# EAGLE design Prop_Dev_Bit_Flicker (EAGLE 7.4.0)
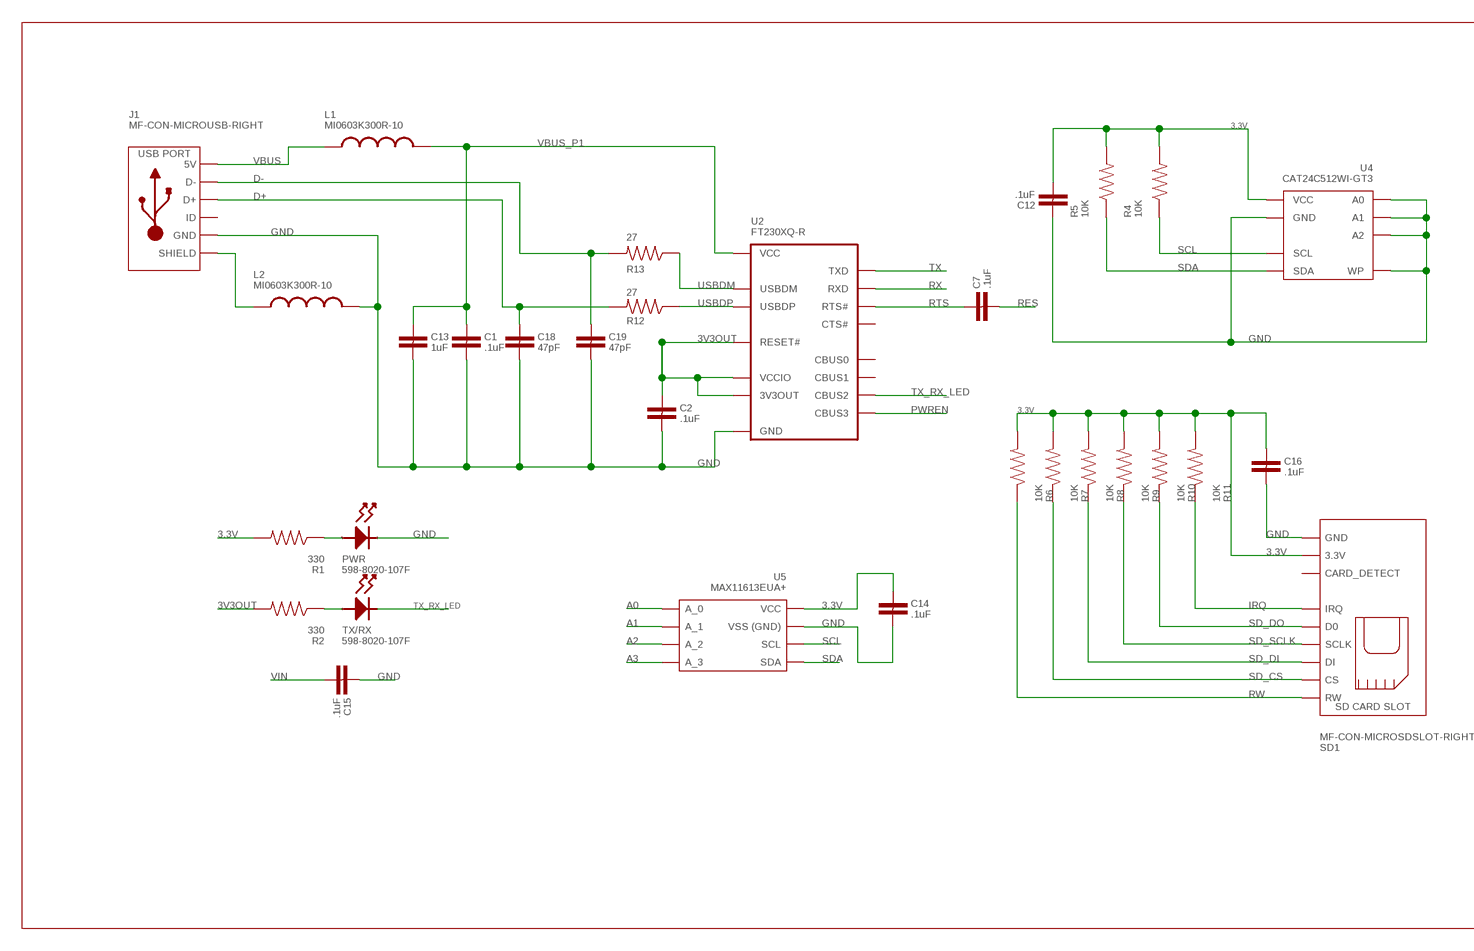
[diagram p0: schematic, sheet 1, part 1 of 2]
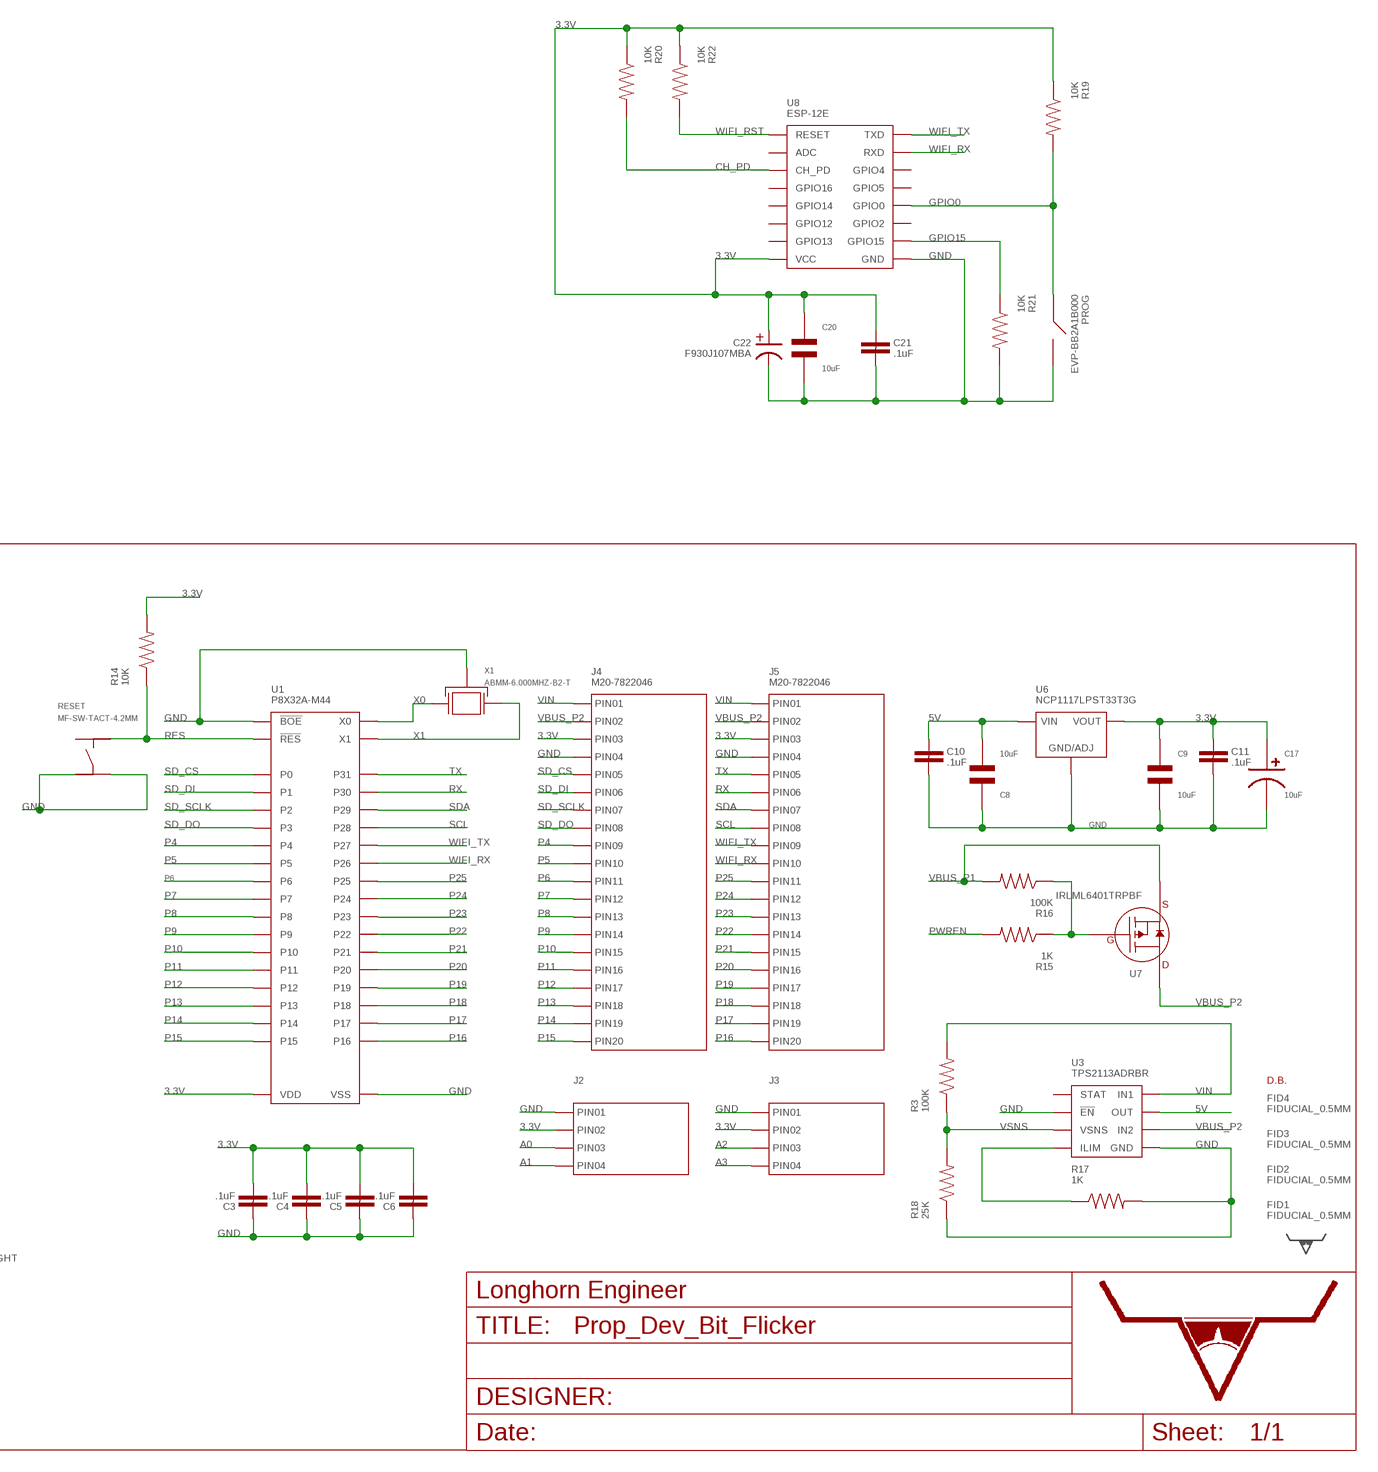
[diagram p1: schematic, sheet 1, part 2 of 2]

## Parts
C1  .1uF  CAPACITOR_NON_POLAR_0603  [0603]
C2  .1uF  CAPACITOR_NON_POLAR_0603  [0603]
C3  .1uF  CAPACITOR_NON_POLAR_0603  [0603]
C4  .1uF  CAPACITOR_NON_POLAR_0603  [0603]
C5  .1uF  CAPACITOR_NON_POLAR_0603  [0603]
C6  .1uF  CAPACITOR_NON_POLAR_0603  [0603]
C7  .1uF  CAPACITOR_NON_POLAR_0603  [0603]
C8  10uF  CAPACITOR_NP_1206  [C1206]
C9  10uF  CAPACITOR_NP_1206  [C1206]
C10  .1uF  CAPACITOR_NON_POLAR_0603  [0603]
C11  .1uF  CAPACITOR_NON_POLAR_0603  [0603]
C12  .1uF  CAPACITOR_NON_POLAR_0603  [0603]
C13  1uF  CAPACITOR_NON_POLAR_0603  [0603]
C14  .1uF  CAPACITOR_NON_POLAR_0603  [0603]
C15  .1uF  CAPACITOR_NON_POLAR_0603  [0603]
C16  .1uF  CAPACITOR_NON_POLAR_0603  [0603]
C17  10uF  CAPACITOR_P_4MM  [CP4MM]
C18  47pF  CAPACITOR_NON_POLAR_0603  [0603]
C19  47pF  CAPACITOR_NON_POLAR_0603  [0603]
C20  10uF  CAPACITOR_NP_1206  [C1206]
C21  .1uF  CAPACITOR_NON_POLAR_0603  [0603]
C22  F930J107MBA  CAPACITOR_POLARIZED_CASE_B  [CASE_B]
FID1  FIDUCIAL_0.5MM  [FIDUCIAL_0.5MM]
FID2  FIDUCIAL_0.5MM  [FIDUCIAL_0.5MM]
FID3  FIDUCIAL_0.5MM  [FIDUCIAL_0.5MM]
FID4  FIDUCIAL_0.5MM  [FIDUCIAL_0.5MM]
J1  MF-CON-MICROUSB-RIGHT  USB_MICRO_RIGHT  [MICROUSB-RIGHT]
J2  CON_01X04_2.54MM_PIN_HEADER  [2.54MM_01X04_PIN_HEADER]
J3  CON_01X04_2.54MM_PIN_HEADER  [2.54MM_01X04_PIN_HEADER]
J4  M20-7822046  CON_01X20_2.54MM_PIN_HEADER  [2.54MM_01X20_PIN_HEADER]
J5  M20-7822046  CON_01X20_2.54MM_PIN_HEADER  [2.54MM_01X20_PIN_HEADER]
L1  MI0603K300R-10  INDUCTOR_0603  [0603]
L2  MI0603K300R-10  INDUCTOR_0603  [0603]
PROG  EVP-BB2A1B000  SPST_EVPBB  [EVPBB]
PWR  598-8020-107F  LED_SINGLE_0805  [LED_0805]
R1  330  RESISTOR_0603  [0603]
R2  330  RESISTOR_0603  [0603]
R3  100K  RESISTOR_0603  [0603]
R4  10K  RESISTOR_0603  [0603]
R5  10K  RESISTOR_0603  [0603]
R6  10K  RESISTOR_0603  [0603]
R7  10K  RESISTOR_0603  [0603]
R8  10K  RESISTOR_0603  [0603]
R9  10K  RESISTOR_0603  [0603]
R10  10K  RESISTOR_0603  [0603]
R11  10K  RESISTOR_0603  [0603]
R12  27  RESISTOR_0603  [0603]
R13  27  RESISTOR_0603  [0603]
R14  10K  RESISTOR_0603  [0603]
R15  1K  RESISTOR_0603  [0603]
R16  100K  RESISTOR_0603  [0603]
R17  1K  RESISTOR_0603  [0603]
R18  25K  RESISTOR_0603  [0603]
R19  10K  RESISTOR_0603  [0603]
R20  10K  RESISTOR_0603  [0603]
R21  10K  RESISTOR_0603  [0603]
R22  10K  RESISTOR_0603  [0603]
RESET  MF-SW-TACT-4.2MM  TACT_4.2MM  [TACT4.2MM]
SD1  MF-CON-MICROSDSLOT-RIGHT  SD_CARD_SLOT_MICRO_RIGHT  [MICROSDSLOT-RIGHT]
TX/RX  598-8020-107F  LED_SINGLE_0805  [LED_0805]
U1  P8X32A-M44  [P8X32A_QFN-44]
U2  FT230XQ-R  FT230XQ  [FT230X_QFN-16]
U3  TPS2113ADRBR  TPS211(2/3)ADR  [TPS211X_SON-8]
U4  CAT24C512WI-GT3  EEPROM_I2CSOIC-8_W  [SOIC-8_W]
U5  MAX11613EUA+  [MAX11613_UMAX-8]
U6  NCP1117LPST33T3G  [SOT-223-3]
U7  IRLML6401TRPBF  MOSFET_P-CHANNEL_SINGLE_SOT-23  [SOT-23-3]
U8  ESP-12E  [ESP-12E]
U$1  LHE_FRAME  [LHE_FRAME]
U$2  LHE_LOGOLHE_LOGO  [LHE_LOGO]
U$3  DB_LOGO_SILK_SMALL  [DB_SILK_SMALL]
X1  ABMM-6.000MHZ-B2-T  XTL_7MMX5MM  [7MMX5MM]

## Nets
3.3V: C3.2 C4.2 C5.2 C6.2 C9.P$1 C11.1 C12.2 C14.1 C16.1 C17.P$1 C20.P$1 C21.1 C22.P(POS) J2.2 J3.2 J4.3 J5.3 R1.2 R4.2 R5.2 R6.2 R7.2 R8.2 R9.2 R10.2 R11.2 R14.2 R19.1 R20.1 R22.1 SD1.PIN4(3.3V) U1.8(VDD) U1.18(VDD) U1.30(VDD) U1.40(VDD) U4.8(VCC) U5.P$8(VCC) U6.P$1(VOUT) U6.P$3(VOUT) U8.P$8(VCC)
3V3OUT: C2.1 R2.2 U2.1(VCCIO) U2.8(3V3OUT) U2.9(RESET#)
5V: C8.P$2 C10.1 U3.7(OUT) U6.P$4(VIN)
A0: J2.3 U5.P$1(A_0)
A1: J2.4 U5.P$2(A_1)
A2: J3.3 U5.P$3(A_2)
A3: J3.4 U5.P$4(A_3)
CH_PD: R20.2 U8.P$3(CH_PD)
D+: C18.1 J1.3(D+) R12.2
D-: C19.1 J1.2(D-) R13.2
GND: C1.2 C2.2 C3.1 C4.1 C5.1 C6.1 C8.P$1 C9.P$2 C10.2 C11.2 C12.1 C13.2 C14.2 C15.1 C16.2 C17.P$2 C18.2 C19.2 C20.P$2 C21.2 C22.N(NEG) J1.5(GND) J2.1 J3.1 J4.4 J5.4 L2.2 PROG.P$3(B) PROG.P$4(B) PWR.CATHODE R17.2 R18.1 R21.2 RESET.P$3 RESET.P$4 SD1.G0(GND) SD1.G1(GND) SD1.PIN6(GND) U1.5(VSS) U1.6(!BOE) U1.17(VSS) U1.27(VSS) U1.39(VSS) U2.3(GND) U2.13(GND) U2.PAD(GND) U3.2(!EN) U3.5(GND) U3.PAD(GND) U4.1(A0) U4.2(A1) U4.3(A2) U4.4(GND) U4.7(WP) U5.P$7(GND) U6.P$2(GND/ADJ) U8.P$15(GND) X1.P$2(GND) X1.P$4(GND)
GPIO0: PROG.P$1(A) PROG.P$2(A) R19.2 U8.P$18(GPIO0)
GPIO15: R21.1 U8.P$16(GPIO15)
IRQ: R11.1 SD1.PIN8(IRQ)
N$1: PWR.ANODE R1.1
N$2: R2.1 TX/RX.ANODE
N$3: J1.S1(SLD) J1.S2(SLD) J1.S3(SLD) J1.S4(SLD) J1.S5(SLD) J1.S6(SLD) L2.1
N$7: R17.1 U3.4(ILIM)
N$41: R15.1 R16.1 U7.1(GATE)
P4: J4.9 U1.1(P4)
P5: J4.10 U1.2(P5)
P6: J4.11 U1.3(P6)
P7: J4.12 U1.4(P7)
P8: J4.13 U1.9(P8)
P9: J4.14 U1.10(P9)
P10: J4.15 U1.11(P10)
P11: J4.16 U1.12(P11)
P12: J4.17 U1.13(P12)
P13: J4.18 U1.14(P13)
P14: J4.19 U1.15(P14)
P15: J4.20 U1.16(P15)
P16: J5.20 U1.19(P16)
P17: J5.19 U1.20(P17)
P18: J5.18 U1.21(P18)
P19: J5.17 U1.22(P19)
P20: J5.16 U1.23(P20)
P21: J5.15 U1.24(P21)
P22: J5.14 U1.25(P22)
P23: J5.13 U1.26(P23)
P24: J5.12 U1.31(P24)
P25: J5.11 U1.32(P25)
PWREN: R15.2 U2.14(CBUS3)
RES: C7.2 R14.1 RESET.P$2 U1.7(!RES)
RTS: C7.1 U2.16(RTS#)
RW: R6.1 SD1.PIN1(RW)
RX: J5.6 U1.37(P30) U2.2(RXD)
SCL: J5.8 R4.1 U1.35(P28) U4.6(SCL) U5.P$5(SCL)
SD_CS: J4.5 R7.1 SD1.PIN2(CS) U1.41(P0)
SD_DI: J4.6 R8.1 SD1.PIN3(DI) U1.42(P1)
SD_DO: J4.8 R10.1 SD1.PIN7(D0) U1.44(P3)
SD_SCLK: J4.7 R9.1 SD1.PIN5(SCLK) U1.43(P2)
SDA: J5.7 R5.1 U1.36(P29) U4.5(SDA) U5.P$6(SDA)
TX: J5.5 U1.38(P31) U2.15(TXD)
TX_RX_LED: TX/RX.CATHODE U2.5(CBUS2)
USBDM: R13.1 U2.7(USBDM)
USBDP: R12.1 U2.6(USBDP)
VBUS: J1.1(5V) L1.1
VBUS_P1: C1.1 C13.1 L1.2 R16.2 U2.10(VCC) U7.2(SOURCE)
VBUS_P2: J4.2 J5.2 U3.6(IN2) U7.3(DRAIN)
VIN: C15.2 J4.1 J5.1 R3.2 U3.8(IN1)
VSNS: R3.1 R18.2 U3.3(VSNS)
WIFI_RST: R22.2 U8.P$1(RESET)
WIFI_RX: J5.10 U1.33(P26) U8.P$21(RXD)
WIFI_TX: J5.9 U1.34(P27) U8.P$22(TXD)
X0: U1.29(X0) X1.P$3(X1)
X1: U1.28(X1) X1.P$1(X0)
Unconnected: J1.4(ID) RESET.P$1 SD1.PIN9(CRD_DTCT) SD1.PIN10(CRD_DTCT) U2.4(CTS#) U2.11(CBUS1) U2.12(CBUS0) U3.1(STAT) U8.P$2(ADC) U8.P$4(GPIO16) U8.P$5(GPIO14) U8.P$6(GPIO12) U8.P$7(GPIO13) U8.P$17(GPIO2) U8.P$19(GPIO4) U8.P$20(GPIO5)

## Library data of the parts
C1-C7 C10-C16 C18 C19 C21 = PP_Passives:CAPACITOR_NON_POLAR: Capacitor Non Polarized
C8 C9 C20 = MF_Passives:CAPACITOR_NP: Library: MF_Passives Description: Device for Non-Polarized Capacitors. Manufacture part number (MFG#), Voltage, Temperature Coefficient, and Tolerance can be added via Attributes.; MFG#: N/A; TEMP_COF: N/A; TOLERANCE: N/A; VOLTAGE: N/A
C17 = MF_Passives:CAPACITOR_P: Library: MF_Passives Description: Device for Polarized Capacitors. Manufacture part number (MFG#), Voltage Rating, and Tolerance can be added via Attributes.; MFG#: N/A; TOLERANCE: N/A; VOLTAGE: N/A
C22 = PP_Passives:CAPACITOR_POLARIZED: Polarized capacitors
FID1-FID4 = MF_Aesthetics:FIDUCIAL: Library: MF_Aesthetics Description: Fiducial marking for PCB alignment inside PNP and other machines.
J1 = MF_Connectors:USB: Library: MF_Connectors Description: 5 Pin USB Connectors. SLD is the shield connection. Usually tied to ground through a small ferrite bead.
J2 J3 = PP_Connectors:CON_01X04: 4 Pin Connectors
J4 J5 = PP_Connectors:CON_01X20
L1 L2 = PP_Passives:INDUCTOR: Inductors
PROG = PP_Electromechanical:SPST: SPST Switches
PWR TX/RX = PP_LED:LED_SINGLE
R1-R22 = PP_Passives:RESISTOR: Resistors
RESET = MF_Switches:TACT: Library: MF_Switches Description: Device for Tact Switches. Manufacture part number (MFG#) can be added via Attributes.
SD1 = MF_Connectors:SD_CARD_SLOT: Library: MF_Connectors Description: SD Card Connector
U1 = PP_DigitalIC:P8X32A: Manufacturer Part #: P8X32A Manufacturer: Parallax Description: 32-bit Microcontrollers - MCU Propeller Chip
U2 = PP_DigitalIC:FT230X: Manufacturer Part #: FT230X Manufacturer: FTDI Description: USB Interface IC USB to Basic Serial UART IC
U3 = PP_PowerIC:TPS211(2/3): Manufacturer Part #: TPS2112 / TPS2113 Manufacturer: Texas Instruments Description: Power Switch ICs - Power Distribution Autoswitching Power Mux
U4 = PP_DigitalIC:EEPROM_I2C
U5 = PP_AnalogIC:MAX11613: Manufacturer Part #: MAX11613 Manufacturer: Maxim Integrated Description: Analog to Digital Converters - ADC 12-Bit 4Ch 94.4sps 3.6V Precision ADC
U6 = MF_IC_Power:NCP1117LP: Manufacturer Part #: NCP1117LP Manufacturer: ON Semiconductor Description: LDO Voltage Regulators
U7 = PP_DiscreteSemi:MOSFET_P-CHANNEL_SINGLE
U8 = PP_Sensors:ESP-12E
U$1 = PP_Aesthetics:LHE_FRAME; DNAME: Parker Dillmann; PNAME: Propeller Development Bit Flicker; REVNUM: REV 2
U$2 = PP_Aesthetics:LHE_LOGO
U$3 = PP_Aesthetics:DB_LOGO
X1 = MF_Frequency_Control:XTL: Library: MF_Frequency_Control Description: Device for Cyrstal Oscillators. Manufacture part number (MFG#) can be added via Attributes.

## Board
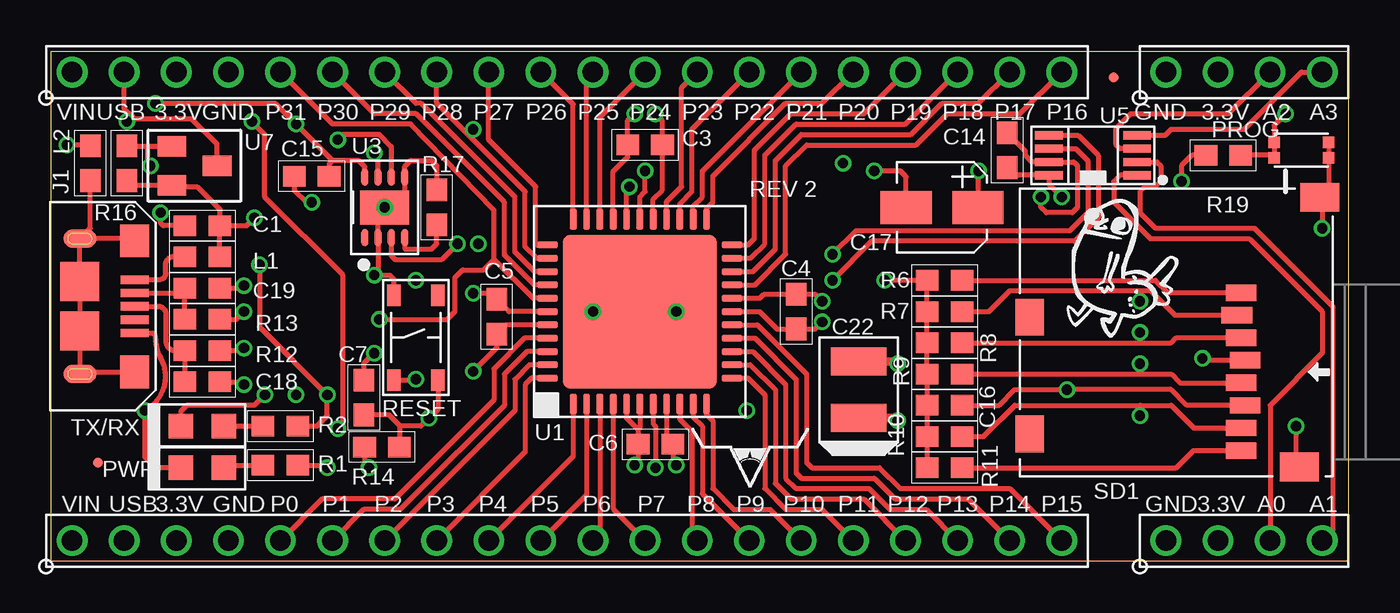
[diagram p2: board, top side]
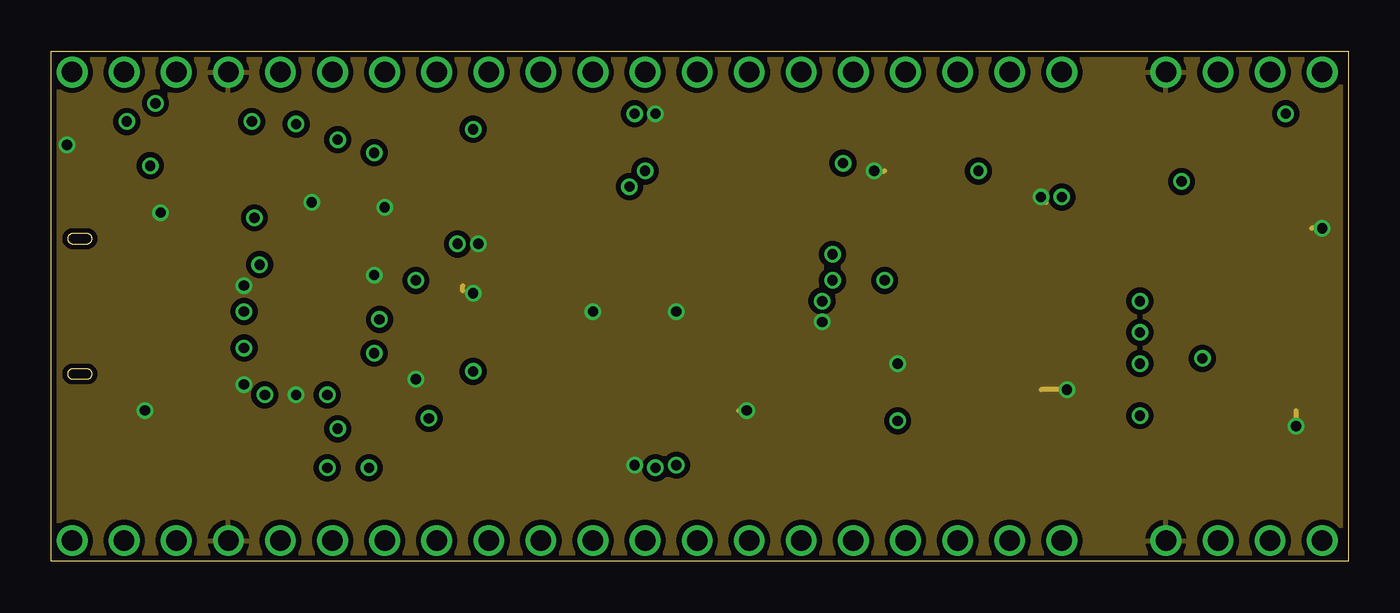
[diagram p3: board, inner layer GND]
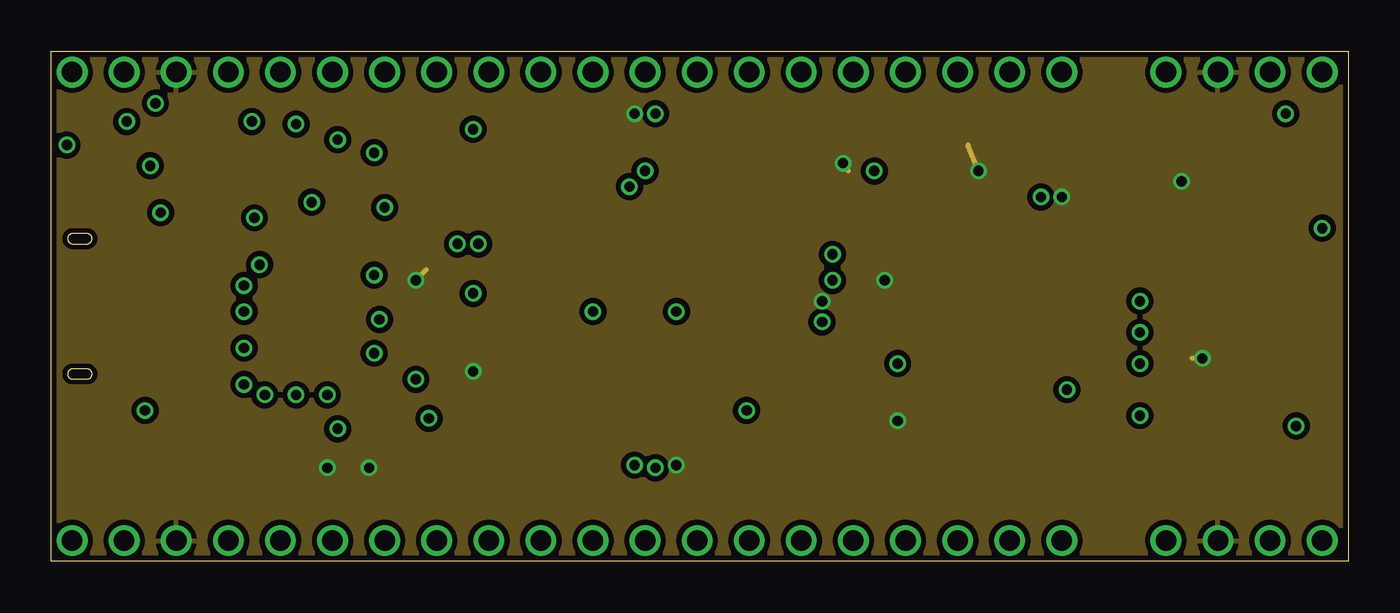
[diagram p4: board, inner layer 3.3V]
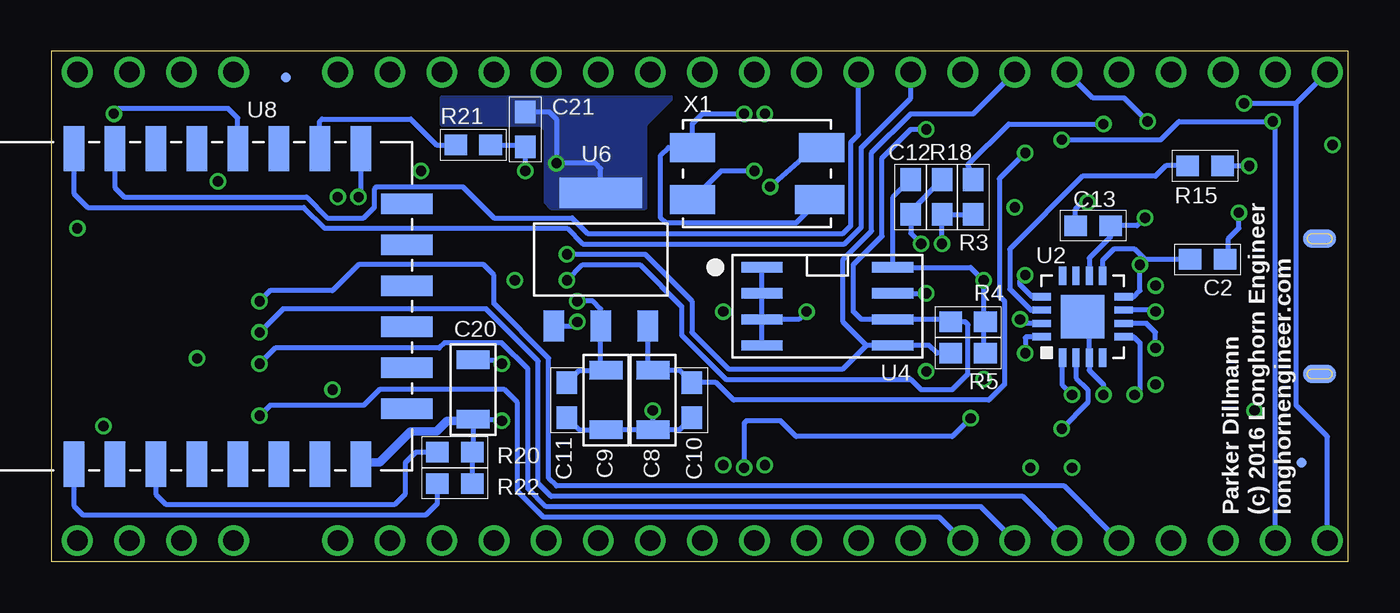
[diagram p5: board, bottom side, seen from below]

Size 63.25 x 24.89 mm. Coordinates in mm from the lower left corner, seen from the top.
Outline: 0,24.89 63.25,24.89 63.25,0 0,0 0,24.89
Copper layers (1*2*15*16): Top 0.035mm / dielectric 0.23mm / GND 0.035mm / dielectric 0.93mm / 3.3V 0.035mm / dielectric 0.23mm / Bottom 0.035mm
Design rules "MF_Standard_4_Layer": minimum track width 6mil, minimum drill 12mil, track to track 6mil, track to pad 6mil, pad to pad 6mil, via to via 6mil, smd to smd 0mil, copper to edge 10mil, drill to drill 10mil, minimum pad ring 6mil, minimum via ring 6mil, stop-mask expansion 2mil, vias tented up to drill 25mil, thermal gap 10mil

### Footprints (pad centres in the part's own frame; a part is rotated, then mirrored left to right if it is on the bottom)
0603 = smd 1.1 x 1: 1 -0.85,0; 2 0.85,0
C1206 = smd 0.9 x 1.6: P$1 -1.45,0; P$2 1.45,0
CP4MM = smd 1.6 x 2.5: P$1 0,-1.75; P$2 0,1.75
CASE_B = smd 1.35 x 2.7: N 1.375,0; P -1.375,0
FIDUCIAL_0.5MM = smd 0.5 x 0.5: FID 0,0
MICROUSB-RIGHT = smd 0.4 x 1.35: 1 -1.3,1.27; 2 -0.65,1.27; 3 0,1.27; 4 0.65,1.27; 5 1.3,1.27 | smd 0.9 x 1.6: S1 -3.3,-1.4; S2 3.3,-1.4 | smd 1.6 x 1.4: S3 -3.2,1.27; S4 3.2,1.27 | smd 1.9 x 1.9: S5 -1.2,-1.405; S6 1.2,-1.405 | smd 0.9 x 1.6 bottom: S7 -3.3,-1.4; S8 3.3,-1.4
2.54MM_01X04_PIN_HEADER = drill 1: 1 -3.81,0; 2 -1.27,0; 3 1.27,0; 4 3.81,0
2.54MM_01X20_PIN_HEADER = drill 1: 1 -24.13,0; 2 -21.59,0; 3 -19.05,0; 4 -16.51,0; 5 -13.97,0; 6 -11.43,0; 7 -8.89,0; 8 -6.35,0; 9 -3.81,0; 10 -1.27,0; 11 1.27,0; 12 3.81,0; 13 6.35,0; 14 8.89,0; 15 11.43,0; 16 13.97,0; 17 16.51,0; 18 19.05,0; 19 21.59,0; 20 24.13,0
EVPBB = smd 0.55 x 0.55: P$1 -1.325,0.375; P$2 -1.325,-0.375; P$3 1.325,-0.375; P$4 1.325,0.375
LED_0805 = smd 1.2 x 1.2: ANODE 1.05,0; CATHODE -1.05,0
TACT4.2MM = smd 1.05 x 0.65: P$1 -2.075,1.075; P$2 2.075,1.075; P$3 -2.075,-1.075; P$4 2.075,-1.075
MICROSDSLOT-RIGHT = smd 1.4 x 1.9: G0 -6.589,7.001; G1 6.561,6.001 | smd 0.8 x 1.5: PIN1 -1.939,3.151; PIN2 -0.839,2.951; PIN3 0.261,3.151; PIN4 1.361,3.351; PIN5 2.461,3.151; PIN6 3.561,3.351; PIN7 4.661,3.151; PIN8 5.761,3.151 | smd 1.8 x 1.4: PIN9 4.961,-7.149; PIN10 -0.739,-7.149
P8X32A_QFN-44 = smd 1 x 0.33: 1 -4.5,3.25; 2 -4.5,2.6; 3 -4.5,1.95; 4 -4.5,1.3; 5 -4.5,0.65; 6 -4.5,0; 7 -4.5,-0.65; 8 -4.5,-1.3; 9 -4.5,-1.95; 10 -4.5,-2.6; 11 -4.5,-3.25; 23 4.5,-3.25; 24 4.5,-2.6; 25 4.5,-1.95; 26 4.5,-1.3; 27 4.5,-0.65; 28 4.5,0; 29 4.5,0.65; 30 4.5,1.3; 31 4.5,1.95; 32 4.5,2.6; 33 4.5,3.25 | smd 0.33 x 1: 12 -3.25,-4.5; 13 -2.6,-4.5; 14 -1.95,-4.5; 15 -1.3,-4.5; 16 -0.65,-4.5; 17 0,-4.5; 18 0.65,-4.5; 19 1.3,-4.5; 20 1.95,-4.5; 21 2.6,-4.5; 22 3.25,-4.5; 34 3.25,4.5; 35 2.6,4.5; 36 1.95,4.5; 37 1.3,4.5; 38 0.65,4.5; 39 0,4.5; 40 -0.65,4.5; 41 -1.3,4.5; 42 -1.95,4.5; 43 -2.6,4.5; 44 -3.25,4.5 | smd 7.5 x 7.5: PAD 0,0
FT230X_QFN-16 = smd 0.9 x 0.35: 1 -2,0.975; 2 -2,0.325; 3 -2,-0.325; 4 -2,-0.975; 9 2,-0.975; 10 2,-0.325; 11 2,0.325; 12 2,0.975 | smd 0.35 x 0.9: 5 -0.975,-2; 6 -0.325,-2; 7 0.325,-2; 8 0.975,-2; 13 0.975,2; 14 0.325,2; 15 -0.325,2; 16 -0.975,2 | smd 2.1 x 2.1: PAD 0,0
TPS211X_SON-8 = smd 0.35 x 0.85: 1 -0.975,-1.475; 2 -0.325,-1.475; 3 0.325,-1.475; 4 0.975,-1.475; 5 0.975,1.475; 6 0.325,1.475; 7 -0.325,1.475; 8 -0.975,1.475 | smd 2.4 x 1.65: PAD 0,0
SOIC-8_W = smd 2 x 0.5: 1 -3.185,1.905; 2 -3.185,0.635; 3 -3.185,-0.635; 4 -3.185,-1.905; 5 3.185,-1.905; 6 3.185,-0.635; 7 3.185,0.635; 8 3.185,1.905
MAX11613_UMAX-8 = smd 1.35 x 0.4: P$1 -2.15,0.975; P$2 -2.15,0.325; P$3 -2.15,-0.325; P$4 -2.15,-0.975; P$5 2.15,-0.975; P$6 2.15,-0.325; P$7 2.15,0.325; P$8 2.15,0.975
SOT-223-3 = smd 4 x 1.5: P$1 0,3.25 | smd 1 x 1.5: P$2 -2.3,-3.25; P$3 0,-3.25; P$4 2.3,-3.25
SOT-23-3 = smd 1 x 1.4: 1 -0.95,-1.1; 2 0.95,-1.1; 3 0,1.1
ESP-12E = smd 2.2 x 1: P$1 -7.7,6.905; P$2 -7.7,4.905; P$3 -7.7,2.905; P$4 -7.7,0.905; P$5 -7.7,-1.095; P$6 -7.7,-3.095; P$7 -7.7,-5.095; P$8 -7.7,-7.095; P$15 7.7,-7.095; P$16 7.7,-5.095; P$17 7.7,-3.095; P$18 7.7,-1.095; P$19 7.7,0.905; P$20 7.7,2.905; P$21 7.7,4.905; P$22 7.7,6.905 | smd 1 x 2.5: P$9 -5,-9.345; P$10 -3,-9.345; P$11 -1,-9.345; P$12 1,-9.345; P$13 3,-9.345; P$14 5,-9.345
7MMX5MM = smd 2.2 x 1.4: P$1 -3.15,-1.27; P$2 -3.15,1.27; P$3 3.15,1.27 | smd 2.4 x 1.4: P$4 3.05,-1.27

### Placement (x,y rotation side)
C1  7.37,16.38 180 top
C2  6.86,14.73 0 bottom
C3  28.96,20.32 180 top
C4  36.32,12.19 90 top
C5  21.72,11.94 270 top
C6  29.46,5.71 0 top
C7  15.24,8 270 top
C8  33.91,7.87 90 bottom
C9  36.2,7.87 270 bottom
C10  32,7.87 270 bottom
C11  38.1,7.87 270 bottom
C12  21.34,17.78 90 bottom
C13  12.45,16.38 180 bottom
C14  46.61,20.07 90 top
C15  12.7,18.8 0 top
C16  43.56,7.62 0 top
C17  43.43,17.27 90 top
C18  7.37,8.76 0 top
C19  7.37,13.34 0 top
C20  42.67,8.38 90 bottom
C21  40.13,21.08 270 bottom
C22  39.37,8.38 90 top
FID1  2.29,4.83 0 top
FID2  51.82,23.62 0 top
FID3  2.29,4.83 0 bottom
FID4  51.82,23.62 0 bottom
J1  2.79,12.45 270 top
J2  58.17,1.02 0 top
J3  58.17,23.88 0 top
J4  25.15,1.02 0 top
J5  25.15,23.88 0 top
L1  7.37,14.86 0 top
L2  1.91,19.43 90 top
PROG  60.96,20.07 0 top
PWR  7.37,4.57 0 top
R1  11.18,4.7 0 top
R2  11.18,6.6 0 top
R3  18.29,17.78 90 bottom
R4  18.54,11.68 0 bottom
R5  18.54,10.16 0 bottom
R6  43.56,13.72 180 top
R7  43.56,12.19 180 top
R8  43.56,10.67 180 top
R9  43.56,9.14 180 top
R10  43.56,6.1 180 top
R11  43.56,4.57 180 top
R12  7.37,10.29 180 top
R13  7.37,11.81 180 top
R14  16.13,5.59 180 top
R15  6.99,19.3 180 bottom
R16  3.68,19.43 270 top
R17  18.8,17.27 90 top
R18  19.81,17.78 270 bottom
R19  57.15,19.81 0 top
R20  43.56,5.33 180 bottom
R21  42.67,20.32 0 bottom
R22  43.56,3.81 180 bottom
RESET  17.78,10.92 270 top
SD1  54.86,11.18 270 top
TX/RX  7.37,6.6 0 top
U1  28.7,12.19 90 top
U2  12.95,11.94 90 bottom
U3  16.26,17.27 0 top
U4  25.4,12.45 0 bottom
U5  50.8,19.81 180 top
U6  36.45,14.73 0 bottom
U7  6.99,19.3 270 top
U8  55.24,12.45 90 bottom
U$1  -1.02,2.29 90 bottom
U$2  36.07,3.56 0 top
U$3  49.53,10.92 0 top
X1  28.83,18.92 0 bottom

### Tracks (layer width: path | path; a pad name or v marks a point on that pad's centre or on a via)
3.3V  (via drill 0.5)
  Top 0.254: R1.2 13.34,4.7 v13.46,4.57 | R14.2 15.28,4.79 v15.49,4.57 | R11.2 R10.2 C16.1 R9.2 R8.2 R7.2 R6.2 v40.64,13.72 | v30.48,4.7 30.31,4.79 C6.2 30,5.9 U1.8 | U1.30 27.4,19.02 28.11,19.72 C3.2 28.11,21.5 v28.45,21.84 | U1.18 34.56,12.84 34.76,13.04 C4.2 37.25,13.04 v37.59,12.7 | SD1.PIN4 56.23,9.81 v56.13,9.91 | C14.1 47.12,18.84 U5.P$8 48.65,18.41 v49.28,17.78 | C17.P$1 45.47,17.55 45.21,17.81 v45.21,19.05 | U1.40 22.17,11.54 C5.2 21.72,10.41 v20.57,9.27 | R19.1 55.63,19.81 55.12,19.3 v55.12,18.54
  Top 0.406: C22.P 41.13,7.01 v41.27,6.86
  3.3V 0.254: v13.46,4.57 13.46,4.32 | v15.49,4.57 15.75,4.57 | v17.78,13.72 18.29,14.22 | v37.59,12.7 37.85,12.7 | v56.13,9.91 55.63,9.91 | v45.21,19.05 44.7,20.32 | v41.27,6.86 41.27,6.6 | v38.61,19.43 38.86,19.05 | v49.28,17.78 49.28,17.53 | v40.64,13.72 40.64,13.97
  Bottom 0.254: 22.73,14.35 U4.8 | U4.8 18.41,14.35 v17.78,13.72 17.78,11.68 | 17.78,11.68 R4.2 | 17.78,11.68 17.78,10.16 R5.2 | C20.P$1 42.67,5.37 R20.1 R22.1 | 42.75,6.86 C20.P$1 | C20.P$1 41.35,6.93 v41.27,6.86 | 40.22,21.84 C21.1 38.95,21.93 38.61,21.59 v38.61,19.43 36.7,19.43 36.45,19.18 U6.P$1 | v37.59,12.7 36.83,12.7 36.45,12.32 U6.P$3 36.45,9.45 C9.P$1 37.5,9.32 C11.1 | C12.2 22.21,17.75 U4.8
  Bottom 0.406: 42.75,6.86 43.94,6.86 44.45,6.35 45.72,6.35 47.24,4.83 48.07,4.83 U8.P$8
  pour 3.3V (isolate 0.254, rank 6): 0,24.89 63.25,24.89 63.25,0 0,0
  pour Bottom (isolate 0.254, rank 6, no thermals): 38.86,17.27 34.29,17.27 34.29,21.08 34.29,21.34 33.02,22.61 44.2,22.61 44.2,21.34 39.37,21.34 39.12,21.08 39.12,17.53
3V3OUT  (via drill 0.5)
  Top 0.254: R2.2 12.95,6.6 13.46,7.11 v13.46,8.13 10.16,11.43 v10.16,14.48
  Bottom 0.254: v13.46,8.13 13.93,8.6 U2.1 | C2.1 9.91,14.73 | 9.91,14.73 10.41,15.24 11.43,15.24 11.98,14.69 U2.9 | U2.8 10.46,12.91 10.16,13.21 v10.16,14.48 9.91,14.73
5V  (via drill 0.5)
  Top 0.254: U3.7 15.93,19.76 v15.75,19.94
  Bottom 0.254: v15.75,19.94 17.02,18.67 17.02,12.95 16.76,12.7 16.76,8.64 17.53,7.87 29.97,7.87 30.82,8.72 C10.1 32.6,9.32 C8.P$2 34.15,9.44 U6.P$4
A0
  Top 0.254: U5.P$1 52.11,18.84 51.82,18.54 51.82,17.53 53.59,15.75 58.42,15.75 61.98,12.19 61.98,10.16 59.44,7.62 J2.3
A1
  Top 0.254: U5.P$2 53.92,19.49 54.1,19.3 54.1,18.54 53.85,18.29 53.34,18.29 53.09,18.03 53.09,17.02 53.85,16.26 58.67,16.26 62.48,12.45 62.48,1.52 J2.4
A2
  Top 0.254: U5.P$3 52.1,20.14 51.91,20.32 51.91,21.12 52.64,21.84 57.4,21.84 J3.3
A3
  Top 0.254: J3.4 60.96,23.88 58.17,21.08 54.61,21.08 54.31,20.79 U5.P$4
CH_PD
  Bottom 0.254: U8.P$3 58.15,3.29 57.66,2.79 46.48,2.79 45.97,3.3 45.97,4.83 45.47,5.33 R20.2
D+
  Top 0.254: J1.3 5.23,12.45 arc-90 5.59,12.09 5.59,10.74 arc90 6.05,10.29 R12.2 C18.1
D-
  Top 0.254: J1.2 6.28,13.1 C19.1 R13.2
GND  (via drill 0.5)
  Top 0.254: C18.2 9.27,8.76 v9.4,8.64 | C19.2 9.27,13.34 v9.4,13.46 | C1.2 5.46,16.38 5.33,16.51 v5.33,17.02 | L2.2 1.87,20.32 v0.76,20.32 | J1.5 4.86,11.15 arc-90 5.08,10.92 arc28 5.33,9.91 arc-90 v4.57,7.37 4.57,5.08 5.08,4.57 PWR.CATHODE | RESET.P$3 16.7,13.78 16.51,13.97 v15.75,13.97 15.93,14.15 U3.2 15.93,16.95 U3.PAD 17.02,17.27 17.23,17.48 U3.5 17.23,19.26 17.53,19.56 18.54,19.56 18.8,19.3 R17.2 | C15.1 11.85,18.12 12.45,17.53 v12.7,17.53 | RESET.P$4 17.74,8.85 v17.78,8.89 | C16.2 46.23,7.62 46.99,8.38 v49.53,8.38 54.61,8.38 55.38,7.62 SD1.PIN6 | v61.98,16.26 61.98,17.65 SD1.G0 62.28,17.77 PROG.P$3 PROG.P$4 | SD1.G1 60.71,5.03 v60.71,6.6 | U1.5 28.05,7 28.61,6.44 | 28.61,6.44 C6.1 28.61,4.79 v28.45,4.7 | U1.6 28.7,6.53 28.61,6.44 | U1.27 29.35,17.67 29.81,18.12 C3.1 29.81,21.5 v29.46,21.84 | U1.17 34.54,12.19 35.39,11.34 C4.1 37.25,11.34 v37.59,11.68 | C14.2 47.5,20.03 47.5,19.81 47.82,19.49 U5.P$7 49.85,19.49 50.04,19.3 50.04,17.27 49.78,17.02 48.51,17.02 48.26,17.27 v48.26,17.78 | U1.39 22.31,12.19 C5.1 21.42,13.08 v20.57,13.08 | C17.P$2 41.68,18.77 41.4,19.05 v40.13,19.05
  Top 0.406: C22.N 41.17,9.76 v41.27,9.65
  GND 0.254: v9.4,8.64 9.65,8.64 | v9.4,13.46 9.4,13.72 | v5.33,17.02 5.08,17.02 | v0.76,20.32 0.76,20.57 | v4.57,7.37 4.57,7.11 | v12.7,17.53 12.45,17.53 | v17.78,8.89 17.78,9.14 | v49.53,8.38 48.26,8.38 | v61.98,16.26 61.47,16.26 | v60.71,6.6 60.71,7.37 | 20.07,13.21 20.07,13.46 | v37.59,11.68 37.59,11.94 | v41.27,9.65 41.02,9.65 | v40.13,19.05 40.64,19.05 | v48.26,17.78 48.51,17.53 | v33.91,7.37 33.53,7.37 | v20.57,13.08 20.57,13.21 | v20.83,15.49 20.83,15.75
  Bottom 0.254: C2.2 5.84,14.9 5.84,15.75 5.33,16.26 v5.33,17.02 | U2.PAD 12.63,11.94 U2.3 12.63,9.33 11.94,8.64 v11.94,8.13 | U2.13 15.41,12.91 16,13.5 16,13.72 v15.75,13.97 | C13.2 13.3,17.18 12.95,17.53 v12.7,17.53 | U4.4 U4.3 | U4.3 U4.2 U4.1 | v29.46,21.84 31.5,21.84 31.98,21.36 X1.P$2 33.15,20.19 33.53,19.81 33.53,16.76 33.27,16.51 26.92,16.51 X1.P$4 | v26.42,12.19 26.8,11.81 U4.3 | C20.P$2 41.45,9.83 v41.27,9.65 | v40.13,19.05 C21.2 40.22,20.32 R21.2 | U8.P$15 48.15,17.89 v48.26,17.78 | U6.P$2 37.79,11.48 v37.59,11.68 | C10.2 32.6,6.42 C8.P$1 | C8.P$1 v33.91,7.37 | C8.P$1 C9.P$2 37.5,6.42 C11.2 | U4.7 v20.57,13.08 | R18.1 21.34,17.11 C12.1 21.34,16 v20.83,15.49
  other vias: 30.48,12.19 16.26,17.27
  pour GND (isolate 0.254, rank 6): 0,24.89 63.25,24.89 63.25,0 0,0
GPIO0  (via drill 0.5)
  Top 0.254: v60.2,21.84 59.63,21.28 PROG.P$1 PROG.P$2 59.51,19.81 R19.2
  Bottom 0.254: U8.P$18 54.15,21.64 54.61,22.1 59.94,22.1 v60.2,21.84
GPIO15
  Bottom 0.254: U8.P$16 50.15,21.48 50.04,21.59 45.72,21.59 44.45,20.32 R21.1
IRQ
  Top 0.254: R11.1 54.86,4.57 55.71,5.42 SD1.PIN8
N$1
  Top 0.254: PWR.ANODE 8.54,4.7 R1.1
N$2
  Top 0.254: TX/RX.ANODE R2.1
N$3
  Top 0.254: J1.S1 1.91,16.26 L2.1 | J1.S3 3.96,15.75 J1.S1 | J1.S1 J1.S5 J1.S6 J1.S2 1.49,9.25 J1.S4
N$7
  Top 0.254: U3.4 17.23,15.28 17.27,15.24 18.54,15.24 18.8,15.49 R17.1
N$41  (via drill 0.5)
  Top 0.254: R16.1 3.71,20.25 4.7,20.25 | 4.7,20.25 U7.1 | v4.83,19.3 4.7,19.43 4.7,20.25
  Bottom 0.254: R15.1 v4.83,19.3
P4
  Top 0.254: U1.1 25.45,5.13 J4.9
P5
  Top 0.254: U1.2 26.1,3.24 J4.10
P6
  Top 0.254: U1.3 26.75,1.35 J4.11
P7
  Top 0.254: U1.4 27.4,2.57 J4.12
P8
  Top 0.254: U1.9 30.65,6.94 31.24,6.35 31.24,1.27 J4.13
P9
  Top 0.254: U1.10 31.3,7.05 31.75,6.6 31.75,3.3 J4.14
P10
  Top 0.254: U1.11 31.95,7.16 32.26,6.86 32.26,3.56 33.27,2.54 35.05,2.54 J4.15
P11
  Top 0.254: U1.12 33.98,8.94 34.8,8.13 34.8,3.56 35.81,2.54 37.59,2.54 J4.16
P12
  Top 0.254: U1.13 34.1,9.59 35.31,8.38 35.31,3.81 36.07,3.05 39.62,3.05 J4.17
P13
  Top 0.254: U1.14 34.21,10.24 35.81,8.64 35.81,4.06 36.32,3.56 39.88,3.56 40.89,2.54 42.67,2.54 J4.18
P14
  Top 0.254: U1.15 34.32,10.89 36.32,8.89 36.32,4.32 36.58,4.06 40.13,4.06 41.15,3.05 44.7,3.05 J4.19
P15
  Top 0.254: U1.16 34.43,11.54 36.83,9.14 36.83,4.83 37.08,4.57 40.39,4.57 41.4,3.56 46.74,3.56 J4.20
P16
  Top 0.254: U1.19 34.32,13.49 35.81,14.99 35.81,19.3 36.83,20.32 42.16,20.32 43.69,21.84 47.24,21.84 J5.20
P17
  Top 0.254: U1.20 34.21,14.14 35.31,15.24 35.31,19.56 36.58,20.83 41.91,20.83 43.43,22.35 45.21,22.35 J5.19
P18
  Top 0.254: U1.21 34.1,14.79 34.8,15.49 34.8,19.81 36.32,21.34 41.66,21.34 J5.18
P19
  Top 0.254: U1.22 33.98,15.44 34.29,15.75 34.29,20.07 36.07,21.84 39.62,21.84 J5.17
P20
  Top 0.254: U1.23 31.95,17.22 32.26,17.53 32.26,18.8 35.81,22.35 37.59,22.35 J5.16
P21
  Top 0.254: U1.24 31.3,17.33 31.75,17.78 31.75,19.05 J5.15
P22
  Top 0.254: U1.25 30.65,17.44 31.24,18.03 31.24,21.08 J5.14
P23
  Top 0.254: U1.26 30,17.56 30.73,18.29 30.73,23.11 J5.13
P24
  Top 0.254: U1.31 26.75,21.67 J5.12
P25
  Top 0.254: U1.32 26.1,23.56 J5.11
PWREN
  Bottom 0.254: R15.2 8.89,19.3 9.4,18.8 12.95,18.8 16.51,15.24 16.51,13.29 15.48,12.26 U2.14
RES  (via drill 0.5)
  Top 0.254: R14.1 17.02,5.63 17.02,6.6 | 17.02,6.6 16.47,7.15 C7.2 | RESET.P$2 18.86,7.42 v18.41,6.99 18.03,6.6 17.02,6.6 | U1.7 29.35,6.72 29.46,6.6 v29.46,4.57
  Bottom 0.254: v18.41,6.99 19.3,6.1 26.92,6.1 27.69,6.86 29.35,6.86 29.46,6.75 v29.46,4.57
RTS  (via drill 0.5)
  Top 0.254: v15.75,10.16 15.24,9.65 C7.1
  Bottom 0.254: U2.16 15.71,10.96 15.75,10.92 v15.75,10.16
RW
  Top 0.254: R6.1 53.85,13.72 54.45,13.12 SD1.PIN1
RX  (via drill 0.5)
  Top 0.254: U1.37 23.56,13.49 22.1,14.96 22.1,17.53 17.78,21.84 15.75,21.84 J5.6 | v13.97,6.48 14.22,6.73 14.22,13.97 10.41,17.78 10.41,20.83 v9.78,21.46
  Bottom 0.254: U2.2 13.28,8.96 12.7,8.38 12.7,7.75 v13.97,6.48 | v9.78,21.46 10.92,22.61 12.45,22.61 J5.6
SCL  (via drill 0.5)
  Top 0.254: U1.35 23.66,14.79 23.11,15.34 23.11,18.03 20.19,20.95 | 20.19,20.95 18.8,22.35 J5.8 | v20.57,21.08 20.32,21.08 20.19,20.95 | U5.P$5 50.08,20.79 51.05,19.81 51.05,16.76 49.91,15.62 40.01,15.62 v38.1,13.72
  Bottom 0.254: v20.57,21.08 21.34,21.08 22.73,19.68 22.73,15.88 24.13,14.48 24.13,12.19 23.75,11.81 U4.6 19.01,11.81 R4.1 18.67,11.68 18.54,11.56 18.54,9.14 19.3,8.38 20.83,8.38 21.34,8.89 30.35,8.89 32.51,11.05 32.51,12.45 34.54,14.48 37.34,14.48 v38.1,13.72
SD_CS  (via drill 0.5)
  Top 0.254: U1.41 23.08,10.89 21.59,9.4 21.59,7.87 16.76,3.05 13.21,3.05 J4.5 | R7.1 45.72,12.19 46.74,13.21 53.09,13.21 | 53.09,13.21 53.59,13.21 54.79,12.02 SD1.PIN2 | v53.09,12.7 53.09,13.21
  Bottom 0.254: J4.5 13.84,3.68 38.61,3.68 38.99,4.06 38.99,9.91 41.66,12.57 41.66,13.97 42.16,14.48 48.26,14.48 49.53,13.21 52.58,13.21 v53.09,12.7
SD_DI  (via drill 0.5)
  Top 0.254: R8.1 53.09,10.67 | 53.09,10.67 54.61,10.67 54.86,10.92 58.01,10.92 SD1.PIN3 | U1.42 23.2,10.24 22.1,9.14 22.1,7.62 17.53,3.05 17.02,2.54 15.24,2.54 J4.6 | v53.09,11.18 53.09,10.67
  Bottom 0.254: J4.6 15.88,3.17 38.86,3.17 39.5,3.81 39.5,9.78 42.04,12.32 51.94,12.32 v53.09,11.18
SD_DO  (via drill 0.5)
  Top 0.254: R10.1 45.47,6.1 46.99,7.62 53.09,7.62 | 53.09,7.62 54.61,7.62 55.72,6.51 SD1.PIN7 | U1.44 23.42,8.94 23.11,8.64 23.11,5.33 J4.8 | v53.09,7.11 53.09,7.62
  Bottom 0.254: J4.8 19.94,2.16 39.24,2.16 40.51,3.43 40.51,7.75 41.15,8.38 47.24,8.38 48.01,7.62 52.58,7.62 v53.09,7.11
SD_SCLK  (via drill 0.5)
  Top 0.254: R9.1 53.09,9.14 | 53.09,9.14 54.61,9.14 55.04,8.71 SD1.PIN5 | U1.43 23.31,9.59 22.61,8.89 22.61,7.37 17.78,2.54 J4.7 | v53.09,9.65 53.09,9.14
  Bottom 0.254: J4.7 17.91,2.67 39.12,2.67 40.01,3.56 40.01,9.4 41.27,10.67 44.07,10.67 44.32,10.41 52.32,10.41 v53.09,9.65
SDA  (via drill 0.5)
  Top 0.254: U1.36 23.57,14.14 22.61,15.11 22.61,17.78 18.03,22.35 17.78,22.35 J5.7 | U5.P$6 49.97,20.14 50.55,19.56 50.55,17.02 49.66,16.13 39.24,16.13 v38.1,14.99
  Bottom 0.254: R5.1 20.07,10.16 20.45,10.54 U4.5 23.5,10.54 | 23.5,10.54 24.64,11.68 24.64,14.73 23.24,16.13 23.24,19.94 21.34,21.84 18.29,21.84 J5.7 | 23.5,10.54 24.64,9.4 30.23,9.4 32,11.18 32,12.7 34.29,14.99 v38.1,14.99
TX  (via drill 0.5)
  Top 0.254: U1.38 23.49,12.84 21.59,14.74 | 21.59,14.74 21.59,17.14 17.53,21.34 13.72,21.34 J5.5 | v16,11.81 19.3,11.81 19.68,12.19 19.68,13.84 20.07,14.22 21.08,14.22 21.59,14.74
  Bottom 0.254: U2.15 15.8,11.61 v16,11.81
TX_RX_LED  (via drill 0.5)
  Top 0.254: v10.41,8.13 9.91,7.62 6.6,7.62 6.32,7.33 TX/RX.CATHODE
  Bottom 0.254: U2.5 10.46,10.96 10.16,10.67 10.16,8.38 v10.41,8.13
USBDM  (via drill 0.5)
  Top 0.254: R13.1 9.02,11.81 v9.4,12.19
  Bottom 0.254: v9.4,12.19 9.47,12.26 U2.7
USBDP  (via drill 0.5)
  Top 0.254: R12.1 9.27,10.29 v9.4,10.41
  Bottom 0.254: v9.4,10.41 9.4,11.18 9.84,11.61 U2.6
VBUS
  Top 0.254: J1.1 5.25,13.75 arc90 5.59,14.09 5.59,14.57 arc-90 6.13,14.86 L1.1
VBUS_P1  (via drill 0.5)
  Top 0.254: L1.2 C1.1 | R16.2 3.91,18.35 U7.2 5.95,18.29 7.11,18.29 8.22,17.18 C1.1 | C1.1 9.53,16.38 v9.91,16.76
  Bottom 0.254: U2.10 12.63,14.8 11.6,15.84 C13.1 10.29,16.38 v9.91,16.76
VBUS_P2  (via drill 0.5)
  Top 0.254: U7.3 8.09,20.36 6.86,21.59 4.06,21.59 3.94,21.72 | J5.2 3.56,22.1 3.94,21.72 | U3.6 16.58,20.25 16,20.83 14.22,20.83 v13.97,20.57 | v3.68,21.46 3.94,21.72
  Bottom 0.254: J4.2 3.56,21.34 v3.68,21.46 8.26,21.46 9.14,20.57 v13.97,20.57
VIN  (via drill 0.5)
  Top 0.254: v5.08,22.35 10.92,22.35 v11.94,21.34 13.72,19.56 | U3.8 15.28,19.26 14.99,19.56 13.72,19.56 | 13.72,19.56 13.55,19.39 C15.2
  Bottom 0.254: v5.08,22.35 2.54,22.35 | 2.54,22.35 J5.1 | J4.1 1.02,6.1 2.54,7.62 2.54,22.35 | R3.2 18.54,19.35 16.56,21.34 v11.94,21.34
VSNS  (via drill 0.5)
  Top 0.254: U3.3 16.58,14.91 16.76,14.73 19.05,14.73 v19.81,15.49
  Bottom 0.254: R3.1 R18.2 v19.81,15.49
WIFI_RST
  Bottom 0.254: U8.P$1 62.15,2.71 61.72,2.29 44.96,2.29 44.41,2.83 R22.2
WIFI_RX
  Top 0.254: J5.10 25.45,22.3 U1.33
  Bottom 0.254: U8.P$21 60.15,18.24 59.69,17.78 50.8,17.78 49.78,16.76 48.01,16.76 47.5,17.27 47.5,18.16 47.37,18.29 43.18,18.29 41.66,16.76 37.85,16.76 37.08,16 24.64,16 24.26,16.38 24.26,20.45 23.88,20.83 J5.10
WIFI_TX
  Top 0.254: J5.9 21.34,20.57 23.62,18.29 23.62,15.49 23.67,15.44 U1.34
  Bottom 0.254: U8.P$22 62.15,17.95 61.47,17.27 50.93,17.27 49.91,16.26 38.1,16.26 37.34,15.49 24.56,15.49 23.75,16.31 23.75,20.19 21.34,22.61 J5.9
X0  (via drill 0.5)
  Top 0.254: U1.29 28.05,18.15 v28.19,18.29
  Bottom 0.254: v28.19,18.29 26.04,20.19 X1.P$3
X1  (via drill 0.5)
  Top 0.254: U1.28 28.7,17.78 28.96,18.03 v28.96,19.05
  Bottom 0.254: v28.96,19.05 30.58,19.05 X1.P$1

### Text on the board
tPlace: VIN | USB | 3.3V | GND | P31 | P30 | P29 | P28 | P27 | P26 | P25 | P24 | P23 | P22 | P21 | P20 | P19 | P18 | P17 | P16 | GND | 3.3V | A2 | A3 | VIN | USB | 3.3V | GND | P0 | P1 | P2 | P3 | P4 | P5 | P6 | P7 | P8 | P9 | P10 | P11 | P12 | P13 | P14 | P15 | GND | 3.3V | A0 | A1